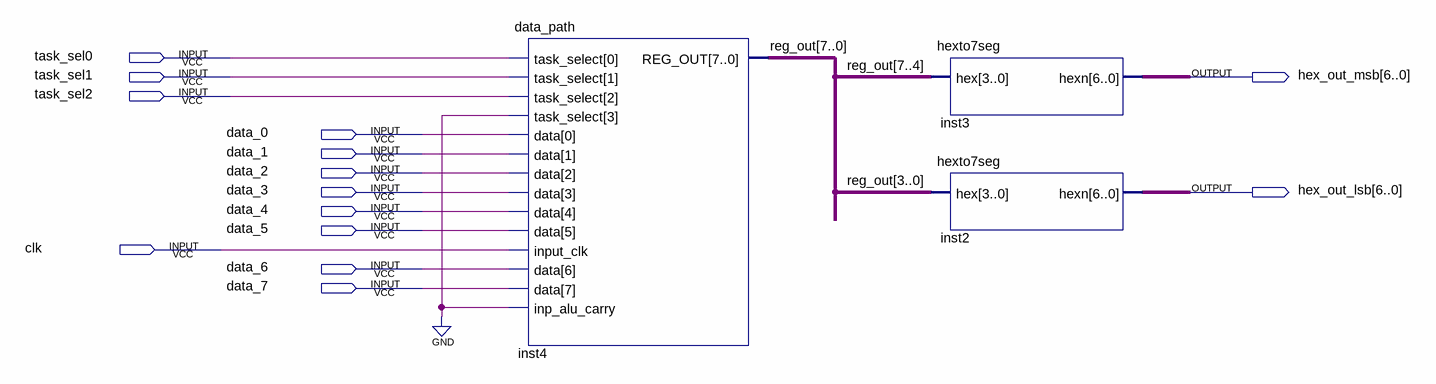
[diagram p0: schematic sheet]
// Quartus schematic Q2.bdf as structural Verilog: 3 symbols, 14 pins
module Q2 (
  input  task_sel0,
  input  task_sel1,
  input  task_sel2,
  input  data_0,
  input  data_1,
  input  data_2,
  input  data_3,
  input  data_4,
  input  data_5,
  input  clk,
  input  data_6,
  input  data_7,
  output [6:0] hex_out_msb,
  output [6:0] hex_out_lsb
);

  wire [7:0] reg_out;

  data_path inst4 (
    .task_select({1'b0, task_sel2, task_sel1, task_sel0}),
    .data({data_7, data_6, data_5, data_4, data_3, data_2, data_1, data_0}), .input_clk(clk),
    .inp_alu_carry(1'b0), .REG_OUT(reg_out));
  hexto7seg inst3 (.hex(reg_out[7:4]), .hexn(hex_out_msb));
  hexto7seg inst2 (.hex(reg_out[3:0]), .hexn(hex_out_lsb));
endmodule
